# Altium schematic sheet HDMI_MicroUSB.SchDoc
size A1
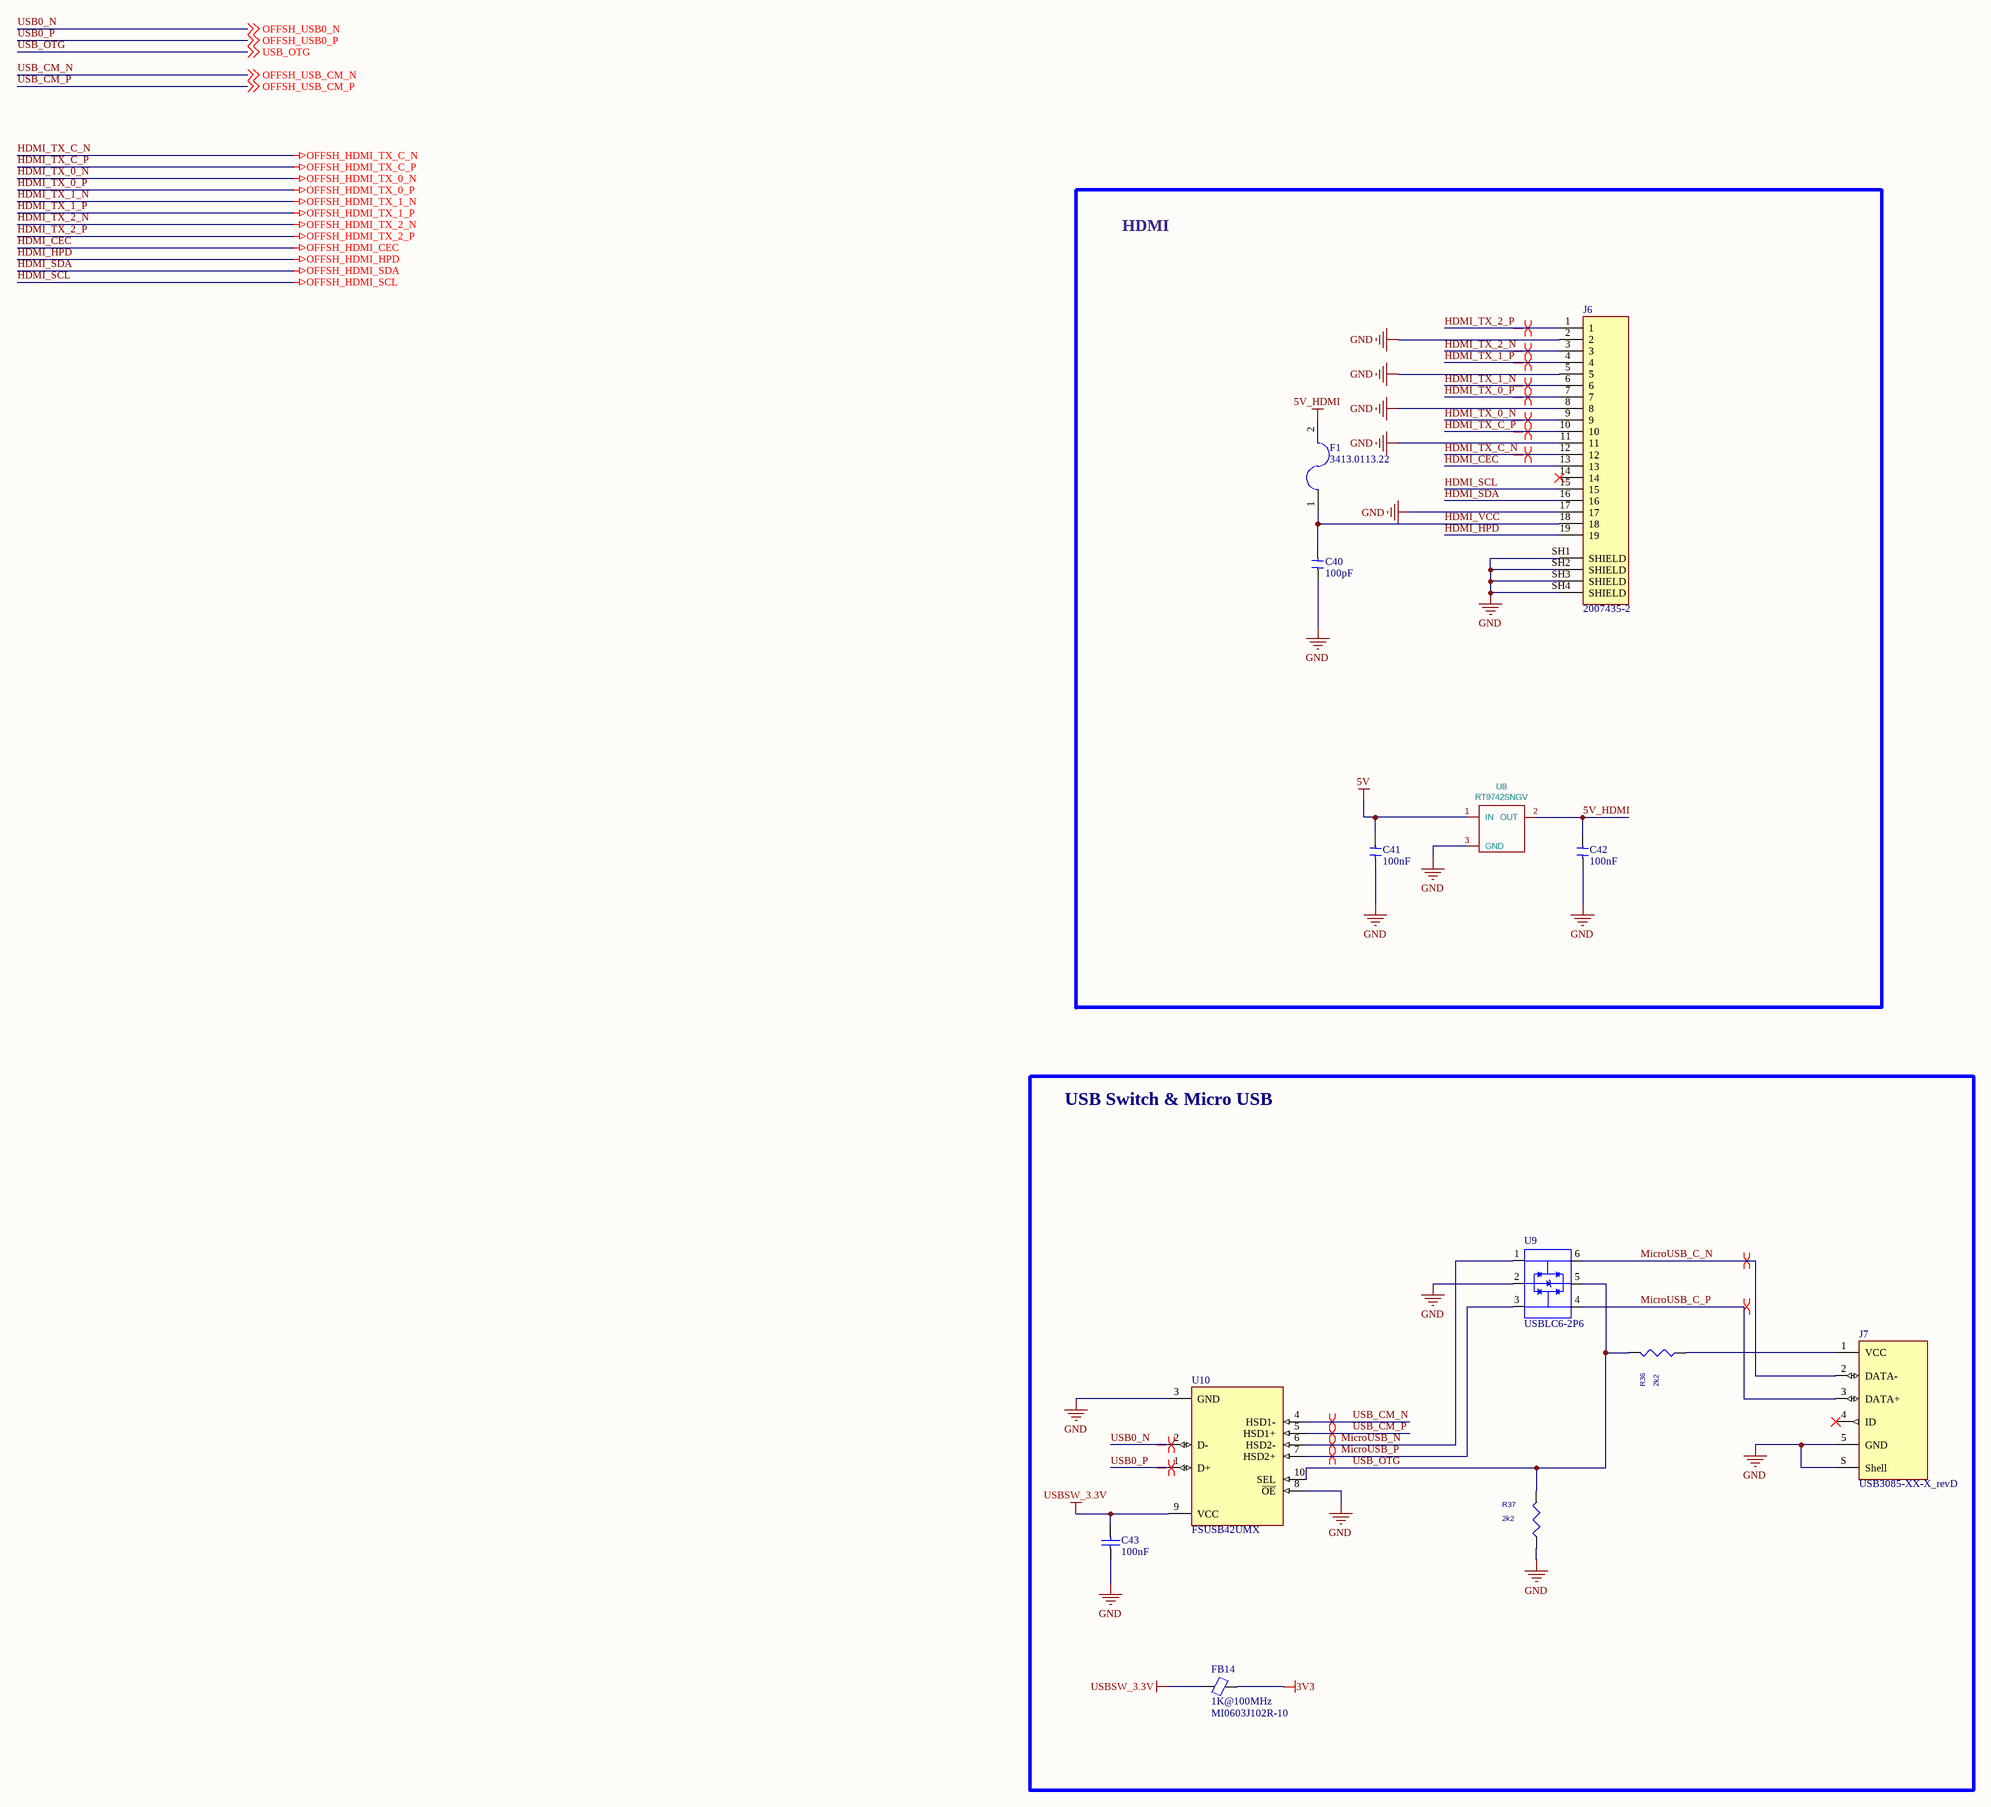
[diagram p0: HDMI_MicroUSB.SchDoc]

## Parts
C40  value 100pF  [0603 Capacitor]  (hidden comment: Capacitor SMD)
C41  value 100nF  [0603 Capacitor]  (hidden comment: Capacitor SMD)
C42  value 100nF  [0603 Capacitor]  (hidden comment: Capacitor SMD)
C43  value 100nF  [CAP (0603)]  (hidden comment: Cap)
F1  Part Number: 3413.0113.22  [FUSE (3413.0120.22)]  (hidden comment: Fuse)
FB14  value 1K@100MHz  Part Number: MI0603J102R-10  [FB0603]  (hidden comment: Ferrite Bead)
J6  2007435-2  [TE_2007435-2]
J7  USB3085-XX-X_revD  [USB3085-XX-X_revD]
R36  2k2  [R0603]
R37  2k2  [R0603]
U8  RT9742SNGV  [SOT-23]
U9  USBLC6-2P6  [SOT50P160X60-6N]
U10  FSUSB42UMX  [ON_Semiconductor_523BC_MFG]

## Blocks framed on the sheet
HDMI: C40-C42 F1 J6 U8
USB Switch & Micro USB: C43 FB14 J7 R36 R37 U9 U10

## Nets
3V3: FB14.2
5V: C41.1 U8.1(IN)
5V_HDMI: C42.1 F1.2 U8.2(OUT)
GND: C40.2 C41.2 C42.2 C43.1 J6.2 J6.5 J6.8 J6.11 J6.17 J6.SH1(SHIELD) J6.SH2(SHIELD) J6.SH3(SHIELD) J6.SH4(SHIELD) J7.5(GND) J7.S(Shell) R37.2 U8.3(GND) U9.2(GND) U10.3(GND) U10.8(~{OE})
HDMI_CEC: J6.13  [also labelled OFFSH_HDMI_CEC]
HDMI_HPD: J6.19  [also labelled OFFSH_HDMI_HPD]
HDMI_SCL: J6.15  [also labelled OFFSH_HDMI_SCL]
HDMI_SDA: J6.16  [also labelled OFFSH_HDMI_SDA]
HDMI_TX_0_N: J6.9  [also labelled OFFSH_HDMI_TX_0_N]
HDMI_TX_0_P: J6.7  [also labelled OFFSH_HDMI_TX_0_P]
HDMI_TX_1_N: J6.6  [also labelled OFFSH_HDMI_TX_1_N]
HDMI_TX_1_P: J6.4  [also labelled OFFSH_HDMI_TX_1_P]
HDMI_TX_2_N: J6.3  [also labelled OFFSH_HDMI_TX_2_N]
HDMI_TX_2_P: J6.1  [also labelled OFFSH_HDMI_TX_2_P]
HDMI_TX_C_N: J6.12  [also labelled OFFSH_HDMI_TX_C_N]
HDMI_TX_C_P: J6.10  [also labelled OFFSH_HDMI_TX_C_P]
USBSW_3.3V: C43.2 FB14.1 U10.9(VCC)
HDMI_VCC: C40.1 F1.1 J6.18
MicroUSB_C_N: J7.2(DATA-) U9.6(I/O1_2)
MicroUSB_C_P: J7.3(DATA+) U9.4(I/O2_2)
MicroUSB_N: U9.1(I/O1_1) U10.6(HSD2-)
MicroUSB_P: U9.3(I/O2_1) U10.7(HSD2+)
USB0_N: U10.2(D-) ; off-sheet OFFSH_USB0_N  [also labelled OFFSH_USB0_N]
USB0_P: U10.1(D+) ; off-sheet OFFSH_USB0_P  [also labelled OFFSH_USB0_P]
USB_CM_N: U10.4(HSD1-) ; off-sheet OFFSH_USB_CM_N  [also labelled OFFSH_USB_CM_N]
USB_CM_P: U10.5(HSD1+) ; off-sheet OFFSH_USB_CM_P  [also labelled OFFSH_USB_CM_P]
USB_OTG: R36.1 R37.1 U9.5(VBUS) U10.10(SEL) ; off-sheet USB_OTG
NetJ7_1: J7.1(VCC) R36.2

Not connected (* = marked no-connect by the designer): J6 14*; J7 4(ID)*

## Layout directives
differential pair: HDMI_TX_0_N, HDMI_TX_0_P, HDMI_TX_1_N, HDMI_TX_1_P, HDMI_TX_2_N, HDMI_TX_2_P, HDMI_TX_C_N, HDMI_TX_C_P, MicroUSB_C_N, MicroUSB_C_P, MicroUSB_N, MicroUSB_P, USB0_N, USB0_P, USB_CM_N, USB_CM_P

## Library data of the parts
C40 C42 = Capacitor SMD: Voltage: 50v
C41 = Capacitor SMD: SMD capacitor; Voltage: 50v
C43 = Cap: SMD capacitor; Voltage: 50V
F1 = Fuse (3413.0113.22): USB Host Fuse; Manufacturer_Name: SCHURTER; Datasheet Link: http://docs-emea.rs-online.com/webdocs/0ce7/0900766b80ce74f5.pdf; Height: 0.6mm; Link: https://www.digikey.sg/product-detail/en/schurter-inc/3413.0113.22/486-1675-1-ND/2870075
FB14 = Ferrite Bead: Ferrite Bead SMD; Link: https://www.digikey.com/product-detail/en/laird-signal-integrity-products/MI0805J102R-10/240-2551-1-ND/1015989
J6 = 2007435-2: Conn HDMI RCP 19 POS Solder RA Thru-Hole 19 Terminal 1 Port T/R; MF: TE Connectivity; Value: *; Package: None; MP: 2007435-2; Price: None; Availability: Unavailable; SnapEDA_Link: https://www.snapeda.com/parts/2007435-2/TE%20Connectivity%20AMP%20Connectors/view-part/1316516/?ref=snap
J7 = USB3085-XX-X_revD: Micro USB Receptacle, Type AB, SMT, Horizontal, Bottom Mount, without Peg
R36 R37 = RES: Value: 470
U8 = RT9742SNGV: Part Description: Power Switch/Driver 1:1 N-Channel 500mA SOT-23-3; Field4: Farnell; Field5: 2575555; Field7: RichTek; Field8: USWI00155; Field6: RT9742SNGV; Value: RT9742SNGV; Footprint: Package_TO_SOT_SMD:SOT-23
U9 = USBLC6-2P6: 17V Clamp 5A _8/20Âµs_ Ipp Tvs Diode Surface Mount SOT-666; MF: STMicroelectronics; Value: *; MP: USBLC6-2P6; SnapEDA_Link: https://www.snapeda.com/parts/USBLC6-2P6/STMicroelectronics/view-part/106846/?ref=snap; Availability: Unavailable; Price: None; Package: SOT-563 STMicroelectronics
U10 = FSUSB42UMX: USB Switch IC 1 Channel 10-UMLP _1.8x1.4_; MF: ON Semiconductor; Package: UFQFN-10 ON Semiconductor; SnapEDA_Link: https://www.snapeda.com/parts/FSUSB42UMX/ON%20Semiconductor/view-part/1672388/?ref=snap; MP: FSUSB42UMX; Value: *; Availability: Unavailable; Price: None